# EAGLE schematic electromiografo (EAGLE 7.6.0)
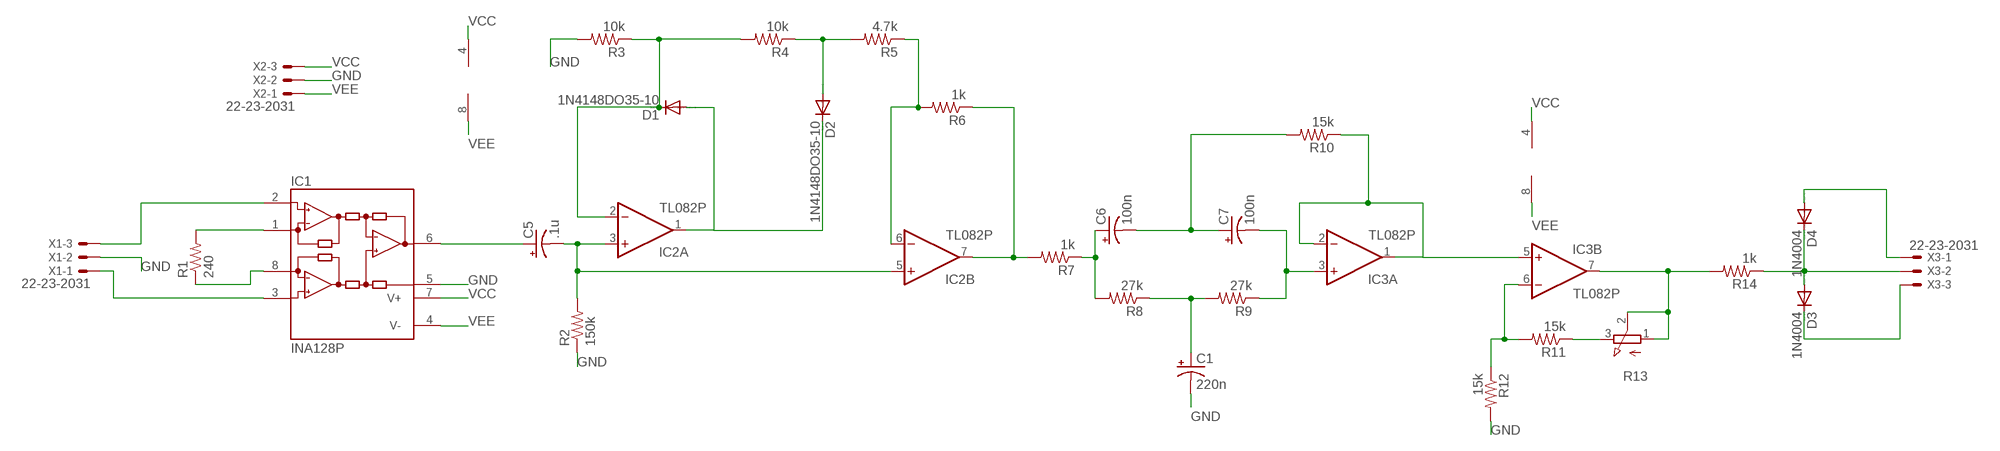
[diagram p0: schematic, sheet 1]

## Parts
C1  220n  CPOL-USE2-5  [E2-5]
C5  .1u  CPOL-USE2-5  [E2-5]
C6  100n  CPOL-USE2-5  [E2-5]
C7  100n  CPOL-USE2-5  [E2-5]
D1  1N4148DO35-10  [DO35-10]
D2  1N4148DO35-10  [DO35-10]
D3  1N4004  [DO41-10]
D4  1N4004  [DO41-10]
IC1  INA128P  [DIL08]
IC2  TL082P  [DIL08]
IC3  TL082P  [DIL08]
R1  240  R-US_0207/12  [0207/12]
R2  150k  R-US_0207/12  [0207/12]
R3  10k  R-US_0207/12  [0207/12]
R4  10k  R-US_0207/12  [0207/12]
R5  4.7k  R-US_0207/12  [0207/12]
R6  1k  R-US_0207/12  [0207/12]
R7  1k  R-US_0207/12  [0207/12]
R8  27k  R-US_0207/12  [0207/12]
R9  27k  R-US_0207/12  [0207/12]
R10  15k  R-US_0207/12  [0207/12]
R11  15k  R-US_0207/12  [0207/12]
R12  15k  R-US_0207/12  [0207/12]
R13  3RP/1610N  [3RP/1610N]
R14  1k  R-US_0207/12  [0207/12]
X1  22-23-2031  [22-23-2031]
X2  22-23-2031  [22-23-2031]
X3  22-23-2031  [22-23-2031]

## Nets
GND: C1.- IC1.5(REF) R2.1 R3.2 R12.2 X1.2 X2.2
N$1: IC1.2(-IN) X1.3
N$2: IC1.1(RG) R1.2
N$3: IC1.8(RG) R1.1
N$4: IC1.3(+IN) X1.1
N$5: D1.C IC2.2(A:-IN) R3.1 R4.2
N$6: C6.+ R7.1 R8.2
N$7: C5.- IC2.3(A:+IN) IC2.5(B:+IN) R2.2
N$8: C6.- C7.+ R10.2
N$9: C5.+ IC1.6(OUT)
N$10: C1.+ R8.1 R9.2
N$11: C7.- IC3.3(A:+IN) R9.1
N$12: IC3.1(A:OUT) IC3.2(A:-IN) IC3.5(B:+IN) R10.1
N$13: D1.A D2.C IC2.1(A:OUT)
N$14: D2.A R4.1 R5.2
N$15: IC2.6(B:-IN) R5.1 R6.2
N$16: IC2.7(B:OUT) R6.1 R7.2
N$17: IC3.6(B:-IN) R11.2 R12.1
N$18: R11.1 R13.3(E)
N$19: IC3.7(B:OUT) R13.1(A) R13.2(S) R14.2
N$20: D3.A D4.C R14.1 X3.2
N$21: D4.A X3.1
N$22: D3.C X3.3
VCC: IC1.7(V+) IC2.4(P:V-) IC3.4(P:V-) X2.3
VEE: IC1.4(V-) IC2.8(P:V+) IC3.8(P:V+) X2.1

## Library data of the parts
C1 C5-C7 = rcl:CPOL-US: POLARIZED CAPACITOR, American symbol
D1 D2 = diode:1N4148: DIODE high speed (Philips)
D3 D4 = diode:1N4004: DIODE general purpose rectifier, 1 A
IC1 = burr-brown:INA128: Instrumentation Amplifiers Precision, Low Power; MF: TEXAS INSTRUMENTS; MPN: INA128P; OC_FARNELL: 1212410; OC_NEWARK: 74C9783
IC2 IC3 = linear:TL082: OP AMP Data sheet <http://www.ti.com/lit/ds/symlink/tl084a . pdf>; DATA_SHEET: <a href="http://www.ti.com/lit/ds/symlink/tl084a.pdf"> Data sheet </a>
R1-R12 R14 = rcl:R-US_: RESISTOR, American symbol
R13 = pot:3RP/1610N: 16mm Potentiometer one level Source: http://www.alphapotentiometers.net/html/16mm_pot_2.html
X1-X3 = con-molex:22-23-2031: .100" (2.54mm) Center Header - 3 Pin; MF: MOLEX; MPN: 22-23-2031; OC_FARNELL: 1462950; OC_NEWARK: 30C0862